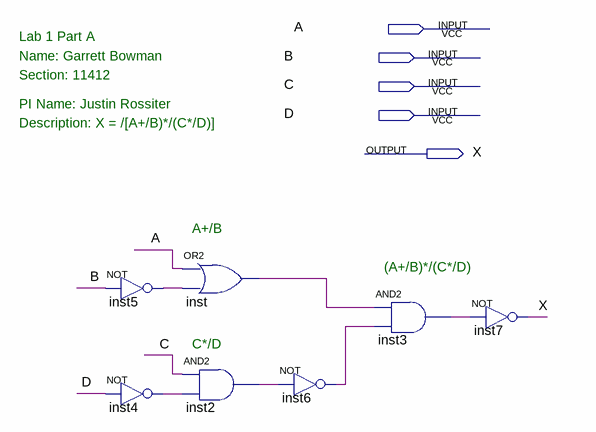
[diagram p0: schematic sheet]
// Quartus schematic Lab1a.bdf as structural Verilog: 7 symbols, 5 pins
module Lab1a (
  input  A,
  input  B,
  input  C,
  input  D,
  output X
);

  wire inst2_out, inst3_out, inst4_out, inst5_out, inst6_out, inst_out;

  not inst5 (inst5_out, B);
  not inst4 (inst4_out, D);
  or inst (inst_out, A, inst5_out);
  and inst2 (inst2_out, C, inst4_out);
  not inst6 (inst6_out, inst2_out);
  and inst3 (inst3_out, inst_out, inst6_out);
  not inst7 (X, inst3_out);

  // Notes on the sheet:
  //   Lab 1 Part A
  //   Name: Garrett Bowman
  //   Section: 11412
  //   PI Name: Justin Rossiter
  //   Description: X = /[A+/B)*/(C*/D)]
  //   A+/B
  //   (A+/B)*/(C*/D)
  //   C*/D
endmodule
